# EAGLE schematic isolated_module_v4 (EAGLE 6.3)
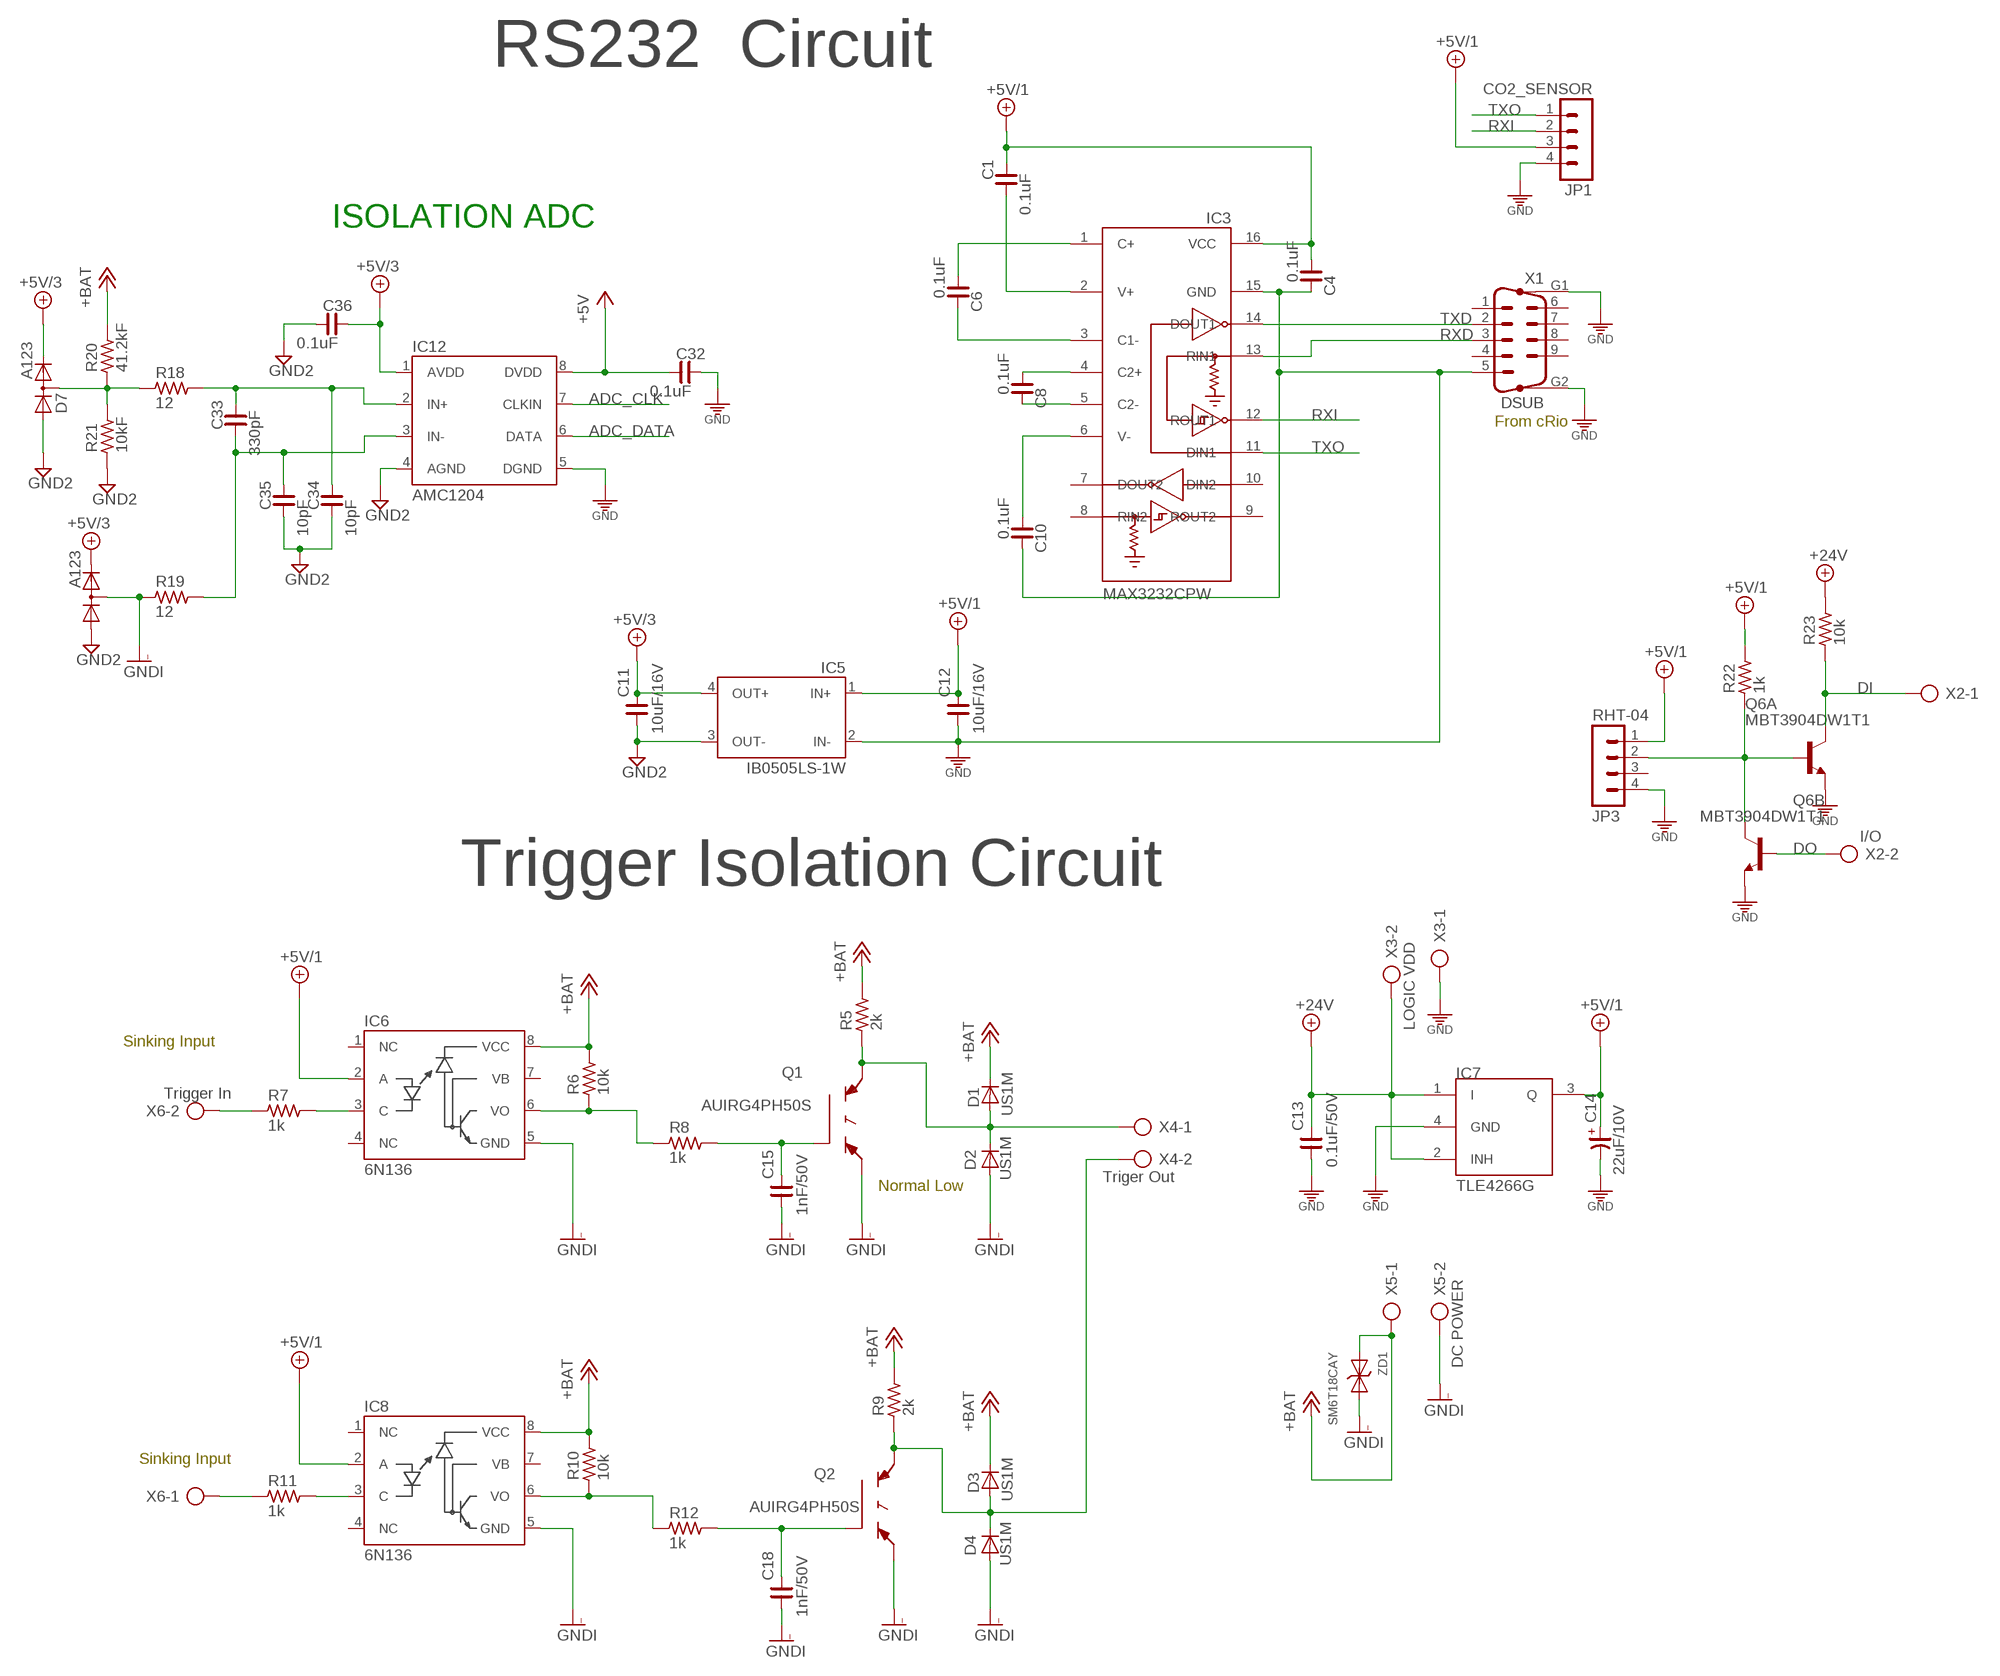
[diagram p0: schematic, sheet 1]

## Parts
C1  0.1uF  C_0603  [C0603]
C4  0.1uF  C_0603  [C0603]
C6  0.1uF  C_0603  [C0603]
C8  0.1uF  C_0603  [C0603]
C10  0.1uF  C_0603  [C0603]
C11  10uF/16V  C_1210  [C1210]
C12  10uF/16V  C_1210  [C1210]
C13  0.1uF/50V  C_0603  [C1608-]
C14  22uF/10V  TANTAL3528  [T3258]
C15  1nF/50V  C_0603  [C1608-]
C18  1nF/50V  C_0603  [C1608-]
C32  0.1uF  C_0603  [C0603]
C33  330pF  C_0603  [C0603]
C34  10pF  C_0603  [C0603]
C35  10pF  C_0603  [C0603]
C36  0.1uF  C_0603  [C0603]
D1  US1M  DIODE-DO-214AC  [DO-214AC]
D2  US1M  DIODE-DO-214AC  [DO-214AC]
D3  US1M  DIODE-DO-214AC  [DO-214AC]
D4  US1M  DIODE-DO-214AC  [DO-214AC]
D7  A123  DIODE_2CACA-SOT23  [SOT23]
D8  A123  DIODE_2CACA-SOT23  [SOT23]
IC3  MAX3232CPW  MAX3232MAX232CPW  [PW_R-PDSO-G16]
IC5  IB0505LS-1W  DSP1N5S5  [DSP1N5S5]
IC6  6N136  [DIL08]
IC7  TLE4266G  [SOT223-4]
IC8  6N136  [DIL08]
IC12  AMC1204  [SO08]
JP1  CO2_SENSOR  MA04-1SMALL  [MA04-1-S]
JP3  RHT-04  MA04-1MOL-N  [MA04-MOL_N]
Q1  AUIRG4PH50S  IGBTAC  [TO247AC]
Q2  AUIRG4PH50S  IGBTAC  [TO247AC]
Q6  MBT3904DW1T1  UMX1N  [UMT6]
R5  2k  R_0805  [R0805]
R6  10k  R_0603  [R0603]
R7  1k  R_0603  [R0603]
R8  1k  R_0603  [R0603]
R9  2k  R_0805  [R0805]
R10  10k  R_0603  [R0603]
R11  1k  R_0603  [R0603]
R12  1k  R_0603  [R0603]
R18  12  R_0603  [R0603]
R19  12  R_0603  [R0603]
R20  41.2kF  R_0603  [R0603]
R21  10kF  R_0603  [R0603]
R22  1k  R_0603  [R0603]
R23  10k  R_0603  [R0603]
X1  DSUB  M09HP  [M09HP]
X2  I/O  AK300/2  [AK300/2]
X3  LOGIC VDD  AK300/2  [AK300/2]
X4  Triger Out  AK300/2  [AK300/2]
X5  DC POWER  AK300/2  [AK300/2]
X6  Trigger In  AK300/2  [AK300/2]
ZD1  SM6T18CAY  ZDSM6T33CAY  [SMB]

## Nets
+5V: C32.2 IC12.8(DVDD)
+5V/1: C1.1 C4.2 C12.2 C14.+ IC3.16(VCC) IC5.1(IN+) IC6.2(A) IC7.3(Q) IC8.2(A) JP1.3 JP3.1 R22.2
+5V/3: C11.2 C36.1 D7.2(C) D8.2(C) IC5.4(OUT+) IC12.1(AVDD)
+12V: D1.C D3.C IC6.8(VCC) IC8.8(VCC) R5.2 R6.2 R9.2 R10.2 R20.2 X5.1 ZD1.A ; supply symbol labelled +BAT
+24V: C13.2 IC7.1(I) IC7.2(INH) R23.2 X3.2
ADC_CLK: IC12.7(CLKIN)
ADC_DATA: IC12.6(DATA)
DI: Q6.6(A:C) R23.1 X2.1
DO: Q6.5(B:B) X2.2
GND [GND]: C4.1 C10.1 C12.1 C13.1 C14.- C32.1 IC3.15(GND) IC5.2(IN-) IC7.4(GND) IC12.5(DGND) JP1.4 JP3.4 Q6.1(A:E) Q6.4(B:E) X1.5 X1.G1 X1.G2 X3.1
GND2 [GND]: C11.1 C34.2 C35.2 C36.2 D7.1(A) D8.1(A) IC5.3(OUT-) IC12.4(AGND) R21.1
GNDI: C15.1 C18.1 D2.A D4.A D8.3(AC) IC6.5(GND) IC8.5(GND) Q1.E Q2.E R19.1 X5.2 ZD1.C(K)
N$1: C15.2 Q1.G R8.2
N$2: IC6.6(VO) R6.1 R8.1
N$3: IC6.3(C) R7.2
N$4: R11.1 X6.1
N$5: IC8.6(VO) R10.1 R12.1
N$6: D3.A D4.C Q2.C R9.1 X4.2
N$7: IC8.3(C) R11.2
N$8: R7.1 X6.2
N$9: C8.1 IC3.5(C2-)
N$10: C18.2 Q2.G R12.2
N$13: C8.2 IC3.4(C2+)
N$14: C10.2 IC3.6(V-)
N$15: C1.2 IC3.2(V+)
N$16: C6.2 IC3.1(C+)
N$17: C6.1 IC3.3(C1-)
N$21: D1.A D2.C Q1.C R5.1 X4.1
N$44: D7.3(AC) R18.1 R20.1 R21.2
N$45: C33.1 C34.1 IC12.2(IN+) R18.2
N$46: C33.2 C35.1 IC12.3(IN-) R19.2
N$47: JP3.2 Q6.2(A:B) Q6.3(B:C) R22.1
RXD: IC3.13(RIN1) X1.3
RXI: IC3.12(ROUT1) JP1.2
TXD: IC3.14(DOUT1) X1.2
TXO: IC3.11(DIN1) JP1.1
Unconnected: IC3.7(DOUT2) IC3.8(RIN2) IC3.9(ROUT2) IC3.10(DIN2) IC6.1(NC) IC6.4(NC) IC6.7(VB) IC8.1(NC) IC8.4(NC) IC8.7(VB) JP3.3 X1.1 X1.4 X1.6 X1.7 X1.8 X1.9

## Notes on the sheet
- RS232  Circuit
- ISOLATION ADC
- From cRio
- Trigger Isolation Circuit
- Sinking Input
- Normal Low
- Sinking Input

## Library data of the parts
C1 C4 C6 C8 C10 C32-C36 = cona_lib:C_: NON-POLARIZED CAP
C11 C12 = rc-master-smd:C_: NON-POLARIZED CAP
C13 C15 C18 = GRU-EURO6:C_: NON-POLARIZED CAP
C14 = GRU-EURO6:TANTAL
D1-D4 = cona_lib:DIODE-: DIODE
D7 D8 = diode:DIODE_2CACA-: 2 Diodes - Cathode-Anode|Cathode-Anode
IC3 = cona_lib:MAX3232: TI
IC5 = cona_lib:DSP1N5S5
IC6 IC8 = cona_lib:6N136
IC7 = GRU-EURO6:TLE4266G
IC12 = cona_lib:AMC1204: TI 20MHz Isolated Delta-Sigma Modulator ADC
JP1 JP3 = cona_lib:MA04-1: PIN HEADER
Q1 Q2 = cona_lib:IGBT
Q6 = rohm:UMX1N: General purpose transistors (dual transistors) Two 2SC2412K chips in a EMT or UMT or SMT package. Source: http://www.rohm.com/products/databook/tr/pdf/umx1n.pdf; MPN: UMX1NTN; OC_FARNELL: 1680410; OC_NEWARK: 40P3417
R5-R12 R18-R23 = cona_lib:R_: RESISTOR
X1 = con-subd:M09HP: SUB-D; OC_FARNELL: unknown; OC_NEWARK: unknown
X2-X6 = con-ptr500:AK300/2: CONNECTOR; OC_FARNELL: unknown; OC_NEWARK: unknown
ZD1 = GRU-EURO6:ZD

## Net classes
0 default: clearance 0.152 mm
1 +5V: width 0.2 mm, clearance 0.152 mm
2 GND: width 0.406 mm, drill 0.203 mm, clearance 0.203 mm